# EasyEDA schematic 1-Schematic_Smart dual relay board.json
TITLE: Smart dual relay board; REV: 2; Date: 2023-02-05; Sheet: 1/1; Drawn By: dmdamen; Company: Beun de Haas B.V.
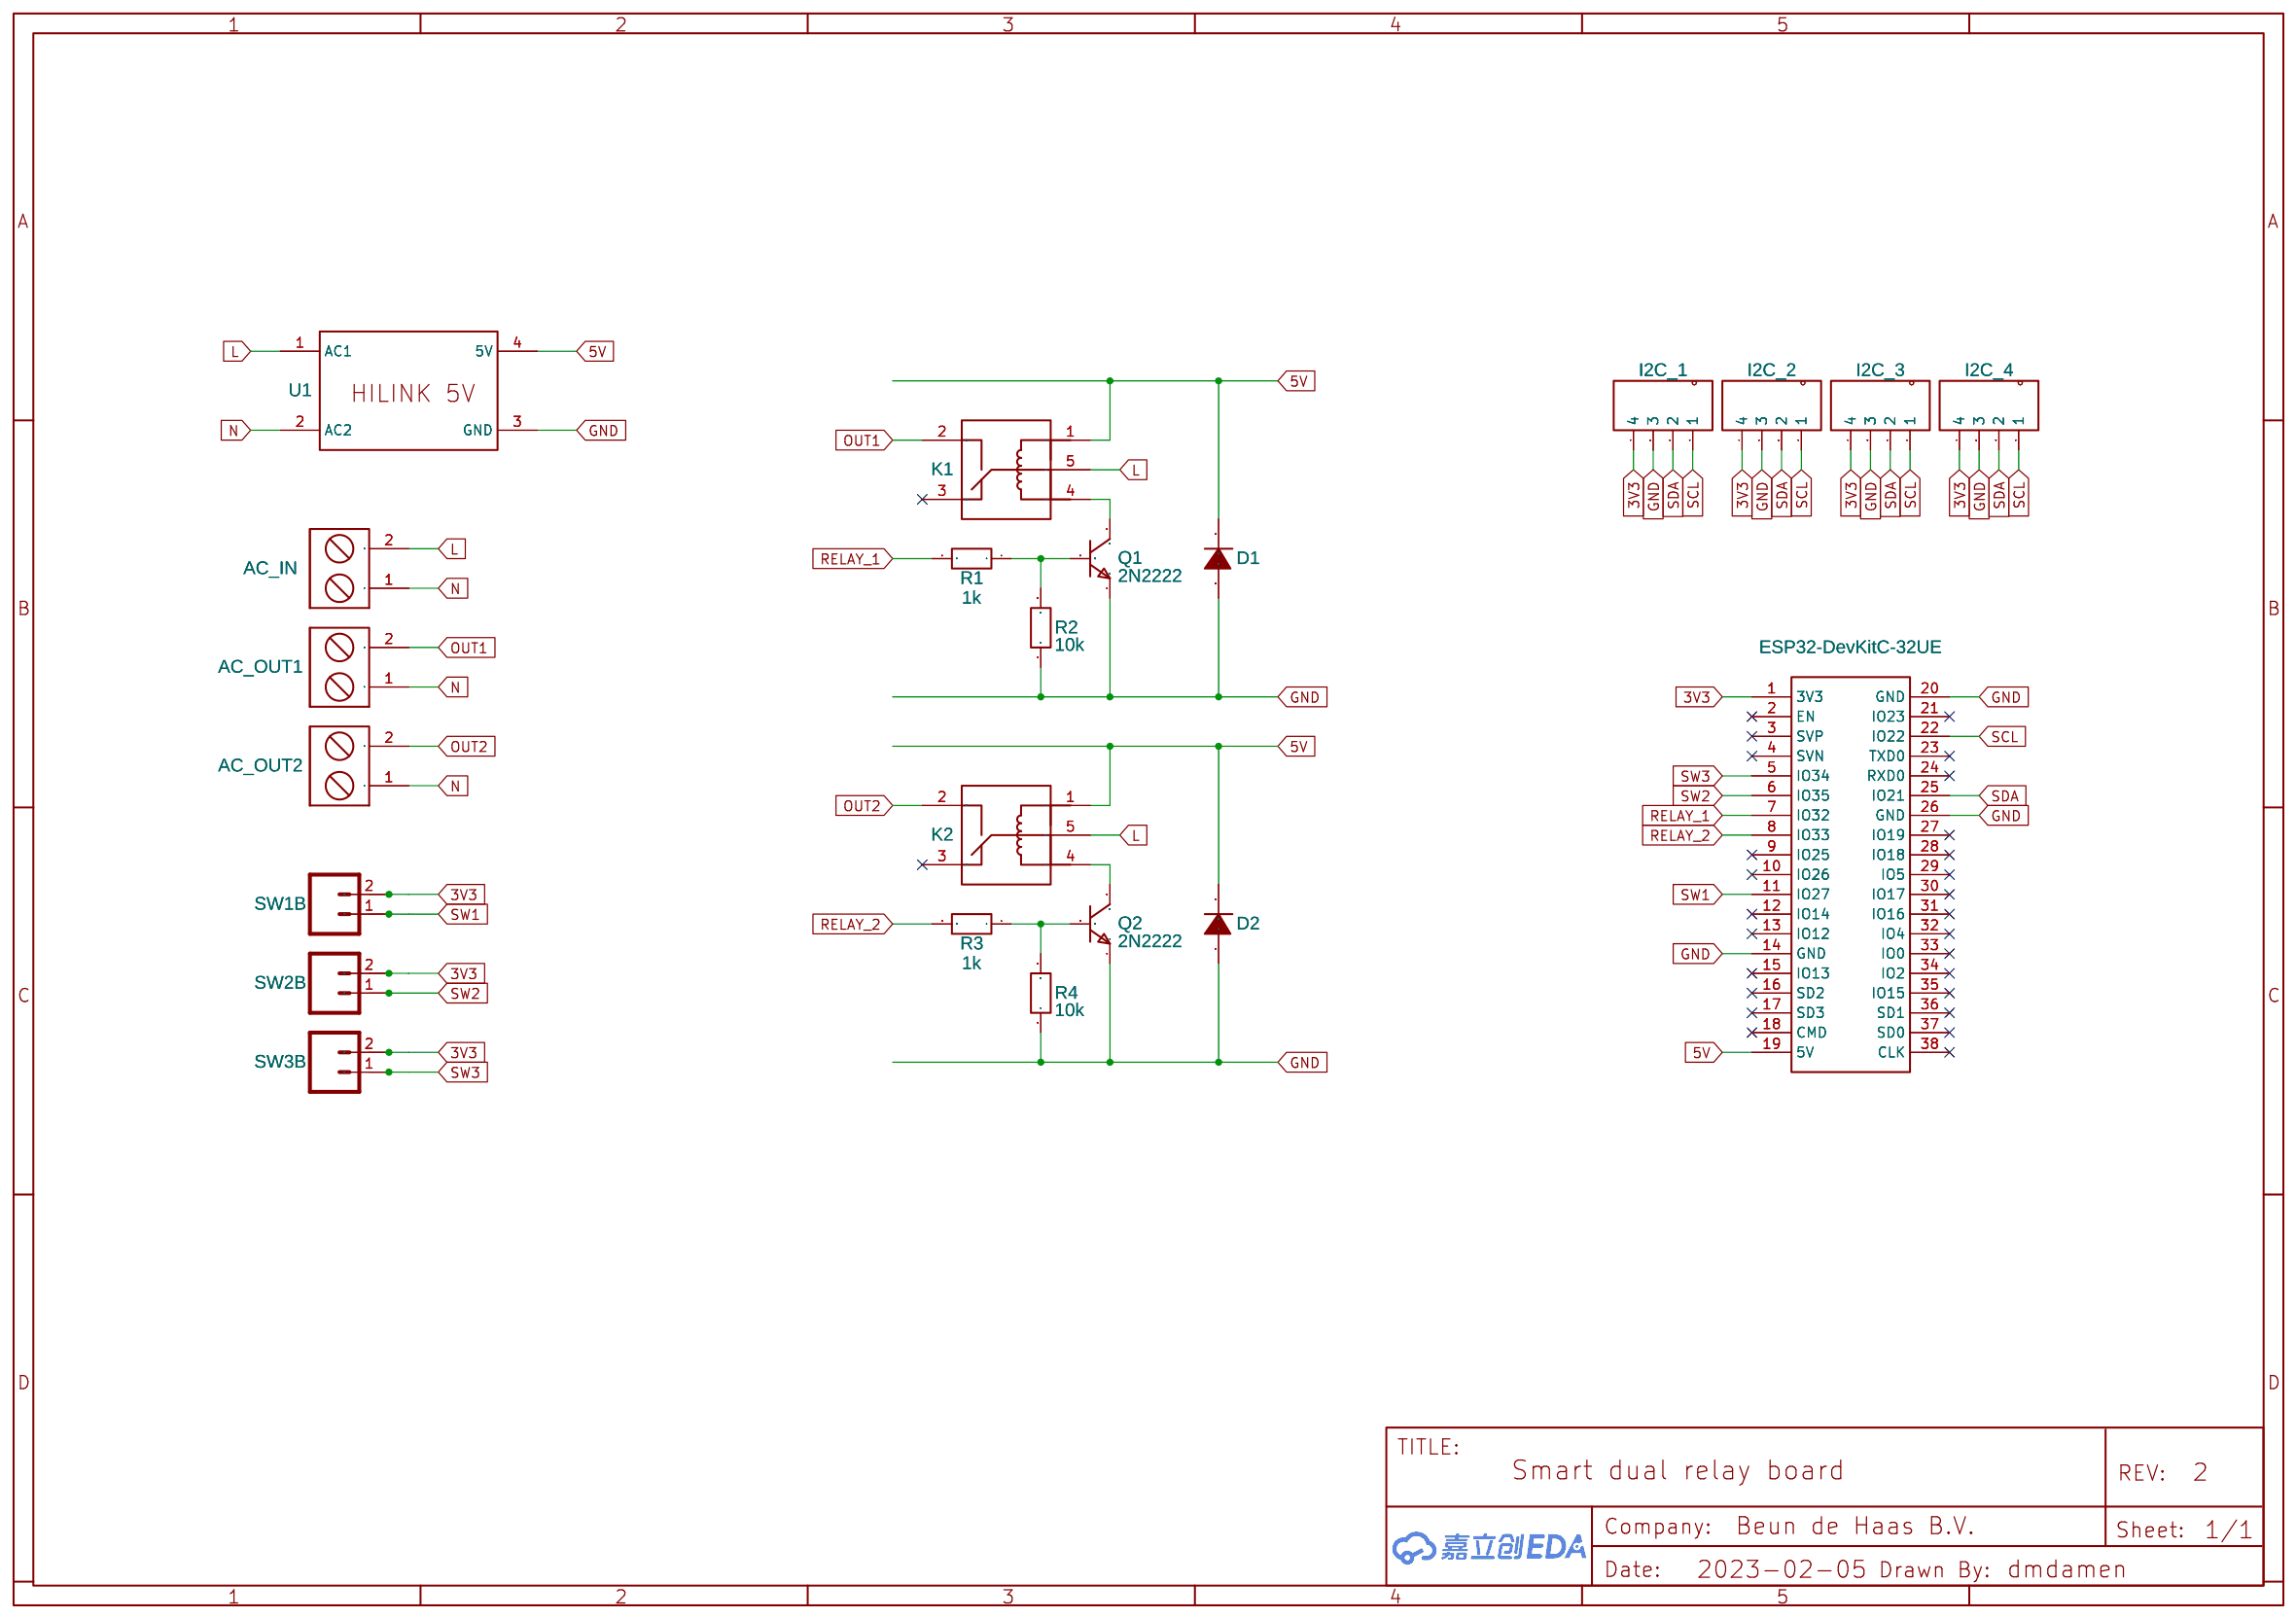
[diagram p0: schematic sheet]

## Parts
AC_IN  10MM SCREW TERMINAL 2P  [10MM SCREWTERMINAL 2P]
AC_OUT1  10MM SCREW TERMINAL 2P  [10MM SCREWTERMINAL 2P]
AC_OUT2  10MM SCREW TERMINAL 2P  [10MM SCREWTERMINAL 2P]
D1  1N4001_C478800  [D_DO-41_SOD81_P12.70MM_HORIZONTAL]
D2  1N4001_C478800  [D_DO-41_SOD81_P12.70MM_HORIZONTAL]
I2C_1  I2C 1  [PINHEADER-4PIN]
I2C_2  I2C 2  [PINHEADER-4PIN]
I2C_3  I2C 3  [PINHEADER-4PIN]
I2C_4  I2C 3  [PINHEADER-4PIN]
K1  SRD-03VDC-SL-C_C496430  [RELAY-TH_SRD-03VDC-SL-C]
K2  SRD-03VDC-SL-C_C496430  [RELAY-TH_SRD-03VDC-SL-C]
Q1  2N2222  [TO-92-3_L4.9-W3.7-P1.27-L]
Q2  2N2222  [TO-92-3_L4.9-W3.7-P1.27-L]
R1  1k  [AXIAL-6.5X2.3(1/4W)]
R2  10k  [AXIAL-6.5X2.3(1/4W)]
R3  1k  [AXIAL-6.5X2.3(1/4W)]
R4  10k  [AXIAL-6.5X2.3(1/4W)]
SW1B  M02  [SCREWTERMINAL-5MM-2]
SW2B  M02  [SCREWTERMINAL-5MM-2]
SW3B  M02  [SCREWTERMINAL-5MM-2]
U1  HILINK 5V corrected  [PWRM-TH_HLK-PM01]
U2  ESP32-DevKitC-32UE  [ESP32-DEVKITC-32UEV.2]

## Library data of the parts
AC_IN AC_OUT1 AC_OUT2 = 7.62MM PITCH 2 PIN BARRIER SCREW TERMINAL BLOCK CONNECTOR 300V 20A: Contributor: LohEeHonG
D1 = 1N4001_C478800: Supplier Part: C478800; Manufacturer: JF(吉福); Manufacturer Part: 1N4001; Contributor: LCSC; JLCPCB Part Class: Extended Part; Package Display: No
D2 = 1N4001_C478800: Supplier Part: C478800; Manufacturer: JF(吉福); Manufacturer Part: 1N4001; Contributor: LCSC; JLCPCB Part Class: Extended Part
I2C_1-I2C_4 = PINHEADER-4PIN: Contributor: Kamil Kowieski
K1 K2 = SRD-03VDC-SL-C_C496430: Supplier: LCSC; Supplier Part: C496430; Manufacturer: 松乐; Manufacturer Part: SRD-03VDC-SL-C; JLCPCB Part Class: Extended Part; Contributor: LCSC
Q1 Q2 = 2N2222: Supplier: LCSC; Manufacturer: ST(先科); Manufacturer Part: 2N2222A; Contributor: LCSC; Supplier Part: C118536; JLCPCB Part Class: Extended Part
R1-R4 = R_0603_EU: Contributor: LCEDA_Lib
SW1B SW2B SW3B = M02: Contributor: SparkFun
U1 = HILINK 5V corrected: Manufacturer Part: HILINK 5V; Contributor: Wittaya; Supplier: AZ-Delivery
U2 = ESP32-DevKitC-32UE: Manufacturer Part: ESP32 DEVKIT V.4; Contributor: PARINYA SAIYOTHA

## Nets
3V3: I2C_1.4 I2C_2.4 I2C_3.4 I2C_4.4 SW1B.2 SW2B.2 SW3B.2 U2.1(3V3)
5V: D1.1(K) D2.1(K) K1.1 K2.1 U1.4(5V) U2.19(5V)
GND: D1.2(A) D2.2(A) I2C_1.3 I2C_2.3 I2C_3.3 I2C_4.3 Q1.1(E) Q2.1(E) R2.1 R4.1 U1.3(GND) U2.14(GND) U2.20(GND) U2.26(GND)
L: AC_IN.2 K1.5 K2.5 U1.1(AC1)
N: AC_IN.1 AC_OUT1.1 AC_OUT2.1 U1.2(AC2)
OUT1: AC_OUT1.2 K1.2
OUT2: AC_OUT2.2 K2.2
RELAY_1: R1.2 U2.7(IO32)
RELAY_2: R3.2 U2.8(IO33)
SCL: I2C_1.1 I2C_2.1 I2C_3.1 I2C_4.1 U2.22(IO22)
SDA: I2C_1.2 I2C_2.2 I2C_3.2 I2C_4.2 U2.25(IO21)
SW1: SW1B.1 U2.11(IO27)
SW2: SW2B.1 U2.6(IO35)
SW3: SW3B.1 U2.5(IO34)
Net-(K1-4): K1.4 Q1.3(C)
Net-(K2-4): K2.4 Q2.3(C)
Net-(Q1-2): Q1.2(B) R1.1 R2.2
Net-(Q2-2): Q2.2(B) R3.1 R4.2

Not connected (* = marked no-connect by the designer): K1 3*; K2 3*; U2 2(EN)* 3(SVP)* 4(SVN)* 9(IO25)* 10(IO26)* 12(IO14)* 13(IO12)* 15(IO13)* 16(SD2)* 17(SD3)* 18(CMD)* 21(IO23)* 23(TXD0)* 24(RXD0)* 27(IO19)* 28(IO18)* 29(IO5)* 30(IO17)* 31(IO16)* 32(IO4)* 33(IO0)* 34(IO2)* 35(IO15)* 36(SD1)* 37(SD0)* 38(CLK)*
